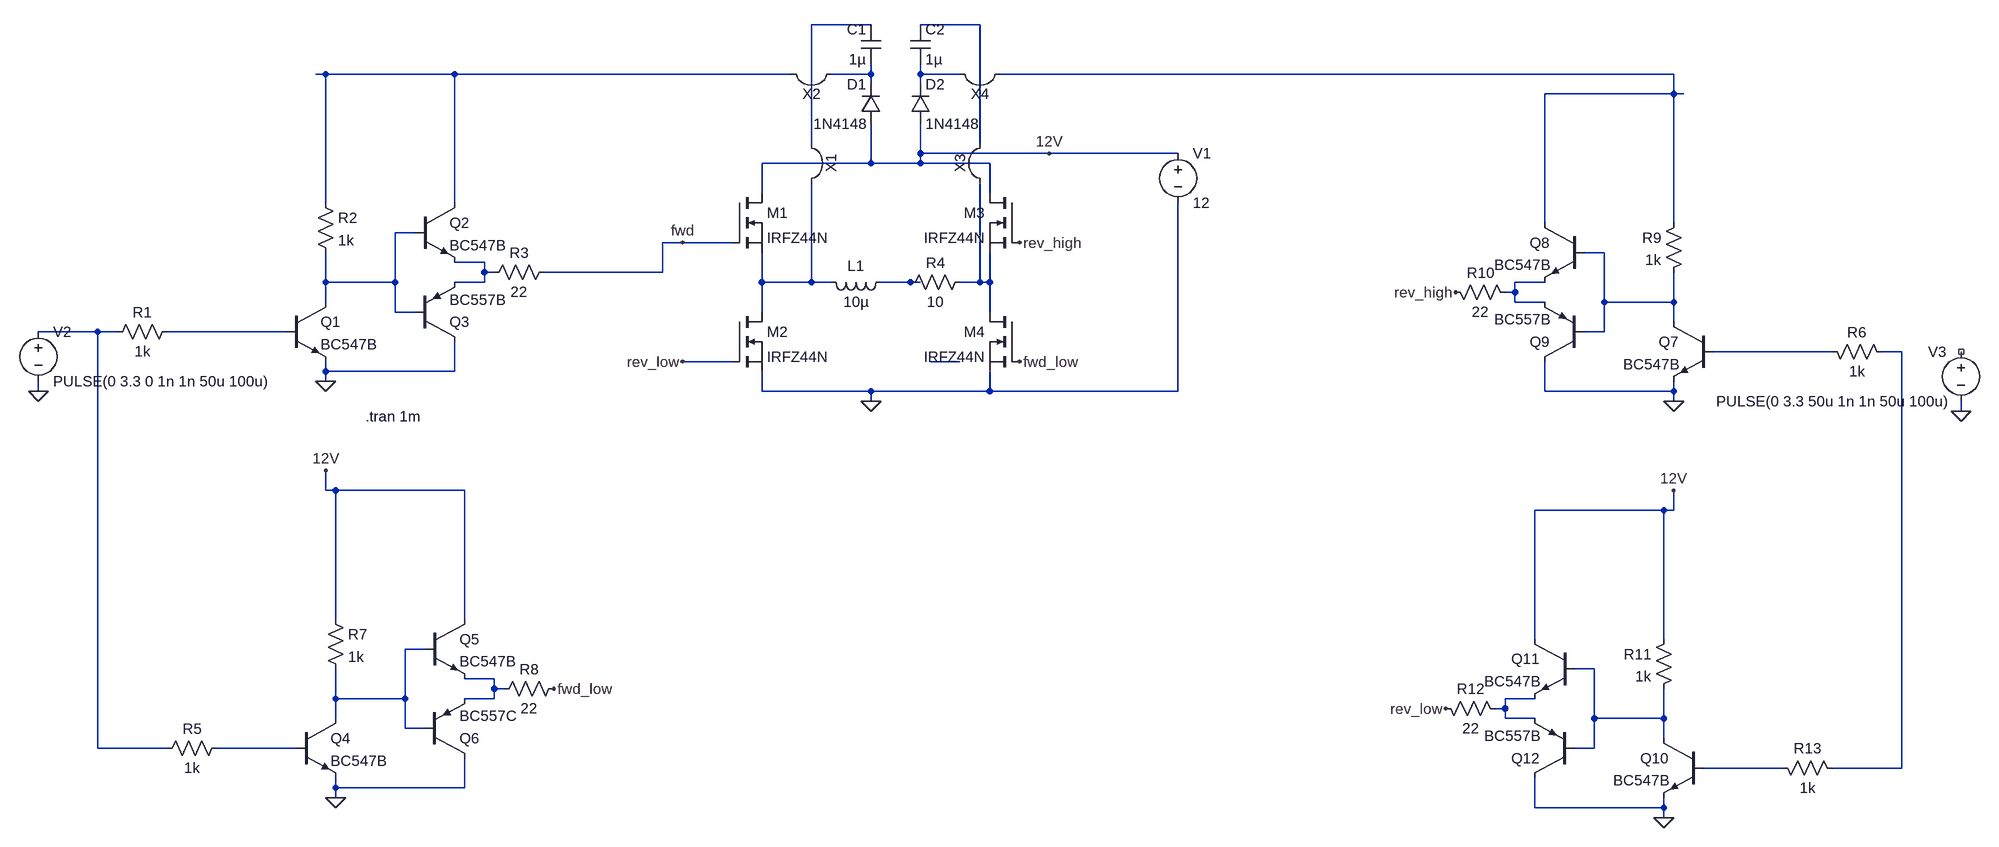
[diagram p0: schematic h-bridge.asc]
h-bridge.asc, the LTspice schematic file:
Version 4
SHEET 1 2020 1028
WIRE 224 -272 128 -272
WIRE 400 -272 304 -272
WIRE -656 -192 -672 -192
WIRE -448 -192 -656 -192
WIRE 96 -192 -448 -192
WIRE 224 -192 224 -208
WIRE 224 -192 160 -192
WIRE 304 -192 304 -208
WIRE 368 -192 304 -192
WIRE 1520 -192 432 -192
WIRE 224 -176 224 -192
WIRE 304 -176 304 -192
WIRE 1520 -160 1520 -192
WIRE 1520 -160 1312 -160
WIRE 1536 -160 1520 -160
WIRE 128 -80 128 -272
WIRE 400 -80 400 -272
WIRE 304 -64 304 -112
WIRE 512 -64 304 -64
WIRE 720 -64 512 -64
WIRE 224 -48 224 -112
WIRE 224 -48 48 -48
WIRE 304 -48 304 -64
WIRE 304 -48 224 -48
WIRE 416 -48 304 -48
WIRE 48 0 48 -48
WIRE 416 0 416 -48
WIRE -656 16 -656 -192
WIRE -448 16 -448 -192
WIRE 1312 48 1312 -160
WIRE 1520 48 1520 -160
WIRE -512 64 -544 64
WIRE -80 80 -112 80
WIRE 0 80 -80 80
WIRE 1408 96 1376 96
WIRE -400 112 -448 112
WIRE -400 128 -400 112
WIRE -384 128 -400 128
WIRE -112 128 -112 80
WIRE -112 128 -304 128
WIRE -656 144 -656 96
WIRE -544 144 -544 64
WIRE -544 144 -656 144
WIRE -400 144 -400 128
WIRE -400 144 -448 144
WIRE 48 144 48 96
WIRE 128 144 128 -16
WIRE 128 144 48 144
WIRE 160 144 128 144
WIRE 288 144 240 144
WIRE 304 144 288 144
WIRE 400 144 400 -16
WIRE 400 144 368 144
WIRE 416 144 416 96
WIRE 416 144 400 144
WIRE 1312 144 1264 144
WIRE 1264 160 1264 144
WIRE 1264 160 1248 160
WIRE -656 176 -656 144
WIRE 1264 176 1264 160
WIRE 1312 176 1264 176
WIRE 1408 176 1408 96
WIRE 1520 176 1520 128
WIRE 1520 176 1408 176
WIRE -544 192 -544 144
WIRE -512 192 -544 192
WIRE 48 192 48 144
WIRE 416 192 416 144
WIRE 1520 208 1520 176
WIRE -1024 224 -1120 224
WIRE -992 224 -1024 224
WIRE -720 224 -912 224
WIRE 1408 224 1408 176
WIRE 1408 224 1376 224
WIRE 1776 256 1584 256
WIRE 1888 256 1856 256
WIRE 0 272 -80 272
WIRE 368 272 320 272
WIRE -656 288 -656 272
WIRE -448 288 -448 240
WIRE -448 288 -656 288
WIRE -656 304 -656 288
WIRE -1120 320 -1120 304
WIRE 48 320 48 288
WIRE 224 320 48 320
WIRE 416 320 416 288
WIRE 416 320 224 320
WIRE 720 320 720 16
WIRE 720 320 416 320
WIRE 1312 320 1312 272
WIRE 1520 320 1520 304
WIRE 1520 320 1312 320
WIRE 224 336 224 320
WIRE 1520 336 1520 320
WIRE 1984 352 1984 336
WIRE -656 480 -656 448
WIRE -640 480 -656 480
WIRE -432 480 -640 480
WIRE 1504 512 1296 512
WIRE 1520 512 1520 480
WIRE 1520 512 1504 512
WIRE -640 688 -640 480
WIRE -432 688 -432 480
WIRE 1296 720 1296 512
WIRE 1504 720 1504 512
WIRE -496 736 -528 736
WIRE 1392 768 1360 768
WIRE -384 784 -432 784
WIRE -384 800 -384 784
WIRE -368 800 -384 800
WIRE -640 816 -640 768
WIRE -528 816 -528 736
WIRE -528 816 -640 816
WIRE -384 816 -384 800
WIRE -384 816 -432 816
WIRE 1296 816 1248 816
WIRE 1248 832 1248 816
WIRE 1248 832 1232 832
WIRE -640 848 -640 816
WIRE 1248 848 1248 832
WIRE 1296 848 1248 848
WIRE 1392 848 1392 768
WIRE 1504 848 1504 800
WIRE 1504 848 1392 848
WIRE -528 864 -528 816
WIRE -496 864 -528 864
WIRE 1504 880 1504 848
WIRE -1024 896 -1024 224
WIRE -912 896 -1024 896
WIRE -704 896 -832 896
WIRE 1392 896 1392 848
WIRE 1392 896 1360 896
WIRE 1696 928 1568 928
WIRE 1888 928 1888 256
WIRE 1888 928 1776 928
WIRE -640 960 -640 944
WIRE -432 960 -432 912
WIRE -432 960 -640 960
WIRE -640 976 -640 960
WIRE 1296 992 1296 944
WIRE 1504 992 1504 976
WIRE 1504 992 1296 992
WIRE 1504 1008 1504 992
FLAG 224 336 0
FLAG -1120 320 0
FLAG -656 304 0
FLAG -80 80 fwd
FLAG 464 272 fwd_low
FLAG -640 976 0
FLAG -288 800 fwd_low
FLAG 512 -64 12V
FLAG -656 448 12V
FLAG 1984 352 0
FLAG 1520 336 0
FLAG 1504 1008 0
FLAG 1152 832 rev_low
FLAG 1520 480 12V
FLAG 1168 160 rev_high
FLAG 464 80 rev_high
FLAG -80 272 rev_low
SYMBOL nmos 0 0 R0
SYMATTR InstName M1
SYMATTR Value IRFZ44N
SYMBOL nmos 0 192 R0
SYMATTR InstName M2
SYMATTR Value IRFZ44N
SYMBOL nmos 464 0 M0
SYMATTR InstName M3
SYMATTR Value IRFZ44N
SYMBOL nmos 464 192 M0
SYMATTR InstName M4
SYMATTR Value IRFZ44N
SYMBOL voltage 720 -80 R0
WINDOW 123 0 0 Left 0
WINDOW 39 0 0 Left 0
SYMATTR InstName V1
SYMATTR Value 12
SYMBOL voltage -1120 208 R0
WINDOW 123 0 0 Left 0
WINDOW 39 0 0 Left 0
SYMATTR InstName V2
SYMATTR Value PULSE(0 3.3 0 1n 1n 50u 100u)
SYMBOL res -896 208 R90
WINDOW 0 0 56 VBottom 2
WINDOW 3 32 56 VTop 2
SYMATTR InstName R1
SYMATTR Value 1k
SYMBOL npn -720 176 R0
SYMATTR InstName Q1
SYMATTR Value BC547B
SYMBOL npn -512 16 R0
SYMATTR InstName Q2
SYMATTR Value BC547B
SYMBOL res -672 0 R0
SYMATTR InstName R2
SYMATTR Value 1k
SYMBOL diode 240 -112 R180
WINDOW 0 24 64 Left 2
WINDOW 3 24 0 Left 2
SYMATTR InstName D1
SYMATTR Value 1N4148
SYMBOL cap 240 -208 R180
WINDOW 0 24 56 Left 2
WINDOW 3 24 8 Left 2
SYMATTR InstName C1
SYMATTR Value 1µ
SYMBOL Misc\\jumper 192 -48 R90
SYMATTR InstName X1
SYMBOL Misc\\jumper 128 -128 R180
SYMATTR InstName X2
SYMBOL pnp -512 240 M180
SYMATTR InstName Q3
SYMATTR Value BC557B
SYMBOL res -288 112 R90
WINDOW 0 0 56 VBottom 2
WINDOW 3 32 56 VTop 2
SYMATTR InstName R3
SYMATTR Value 22
SYMBOL res 384 128 R90
WINDOW 0 0 56 VBottom 2
WINDOW 3 32 56 VTop 2
SYMATTR InstName R4
SYMATTR Value 10
SYMBOL npn -704 848 R0
SYMATTR InstName Q4
SYMATTR Value BC547B
SYMBOL npn -496 688 R0
SYMATTR InstName Q5
SYMATTR Value BC547B
SYMBOL res -656 672 R0
SYMATTR InstName R7
SYMATTR Value 1k
SYMBOL pnp -496 912 M180
SYMATTR InstName Q6
SYMATTR Value BC557C
SYMBOL res -272 784 R90
WINDOW 0 0 56 VBottom 2
WINDOW 3 32 56 VTop 2
SYMATTR InstName R8
SYMATTR Value 22
SYMBOL res -816 880 R90
WINDOW 0 0 56 VBottom 2
WINDOW 3 32 56 VTop 2
SYMATTR InstName R5
SYMATTR Value 1k
SYMBOL voltage 1984 240 M0
WINDOW 123 0 0 Left 0
WINDOW 39 0 0 Left 0
SYMATTR InstName V3
SYMATTR Value PULSE(0 3.3 50u 1n 1n 50u 100u)
SYMBOL res 1760 240 M90
WINDOW 0 0 56 VBottom 2
WINDOW 3 32 56 VTop 2
SYMATTR InstName R6
SYMATTR Value 1k
SYMBOL npn 1584 208 M0
SYMATTR InstName Q7
SYMATTR Value BC547B
SYMBOL npn 1376 48 M0
SYMATTR InstName Q8
SYMATTR Value BC547B
SYMBOL res 1536 32 M0
SYMATTR InstName R9
SYMATTR Value 1k
SYMBOL pnp 1376 272 R180
SYMATTR InstName Q9
SYMATTR Value BC557B
SYMBOL res 1152 144 M90
WINDOW 0 0 56 VBottom 2
WINDOW 3 32 56 VTop 2
SYMATTR InstName R10
SYMATTR Value 22
SYMBOL npn 1568 880 M0
SYMATTR InstName Q10
SYMATTR Value BC547B
SYMBOL npn 1360 720 M0
SYMATTR InstName Q11
SYMATTR Value BC547B
SYMBOL res 1520 704 M0
SYMATTR InstName R11
SYMATTR Value 1k
SYMBOL pnp 1360 944 R180
SYMATTR InstName Q12
SYMATTR Value BC557B
SYMBOL res 1136 816 M90
WINDOW 0 0 56 VBottom 2
WINDOW 3 32 56 VTop 2
SYMATTR InstName R12
SYMATTR Value 22
SYMBOL res 1680 912 M90
WINDOW 0 0 56 VBottom 2
WINDOW 3 32 56 VTop 2
SYMATTR InstName R13
SYMATTR Value 1k
SYMBOL diode 288 -112 M180
WINDOW 0 24 64 Left 2
WINDOW 3 24 0 Left 2
SYMATTR InstName D2
SYMATTR Value 1N4148
SYMBOL cap 288 -208 M180
WINDOW 0 24 56 Left 2
WINDOW 3 24 8 Left 2
SYMATTR InstName C2
SYMATTR Value 1µ
SYMBOL Misc\\jumper 336 -48 M90
SYMATTR InstName X3
SYMBOL Misc\\jumper 400 -128 M180
SYMATTR InstName X4
SYMBOL ind 256 128 R90
WINDOW 0 5 56 VBottom 2
WINDOW 3 32 56 VTop 2
SYMATTR InstName L1
SYMATTR Value 10µ
TEXT -592 360 Left 2 !.tran 1m

The netlist it stands for:
* h-bridge.asc
M1 12V fwd N001 N001 IRFZ44N
M2 N001 rev_low 0 0 IRFZ44N
M3 12V rev_high N002 N002 IRFZ44N
M4 N002 fwd_low 0 0 IRFZ44N
V1 12V 0 12
V2 N010 0 PULSE(0 3.3 0 1n 1n 50u 100u)
R1 N011 N010 1k
Q1 N005 N011 0 0 BC547B
Q2 N003 N005 N007 0 BC547B
R2 N003 N005 1k
D1 12V N003 1N4148
C1 N003 N001 1µ
Q3 0 N005 N007 0 BC557B
R3 fwd N007 22
R4 N002 N008 10
Q4 N015 N019 0 0 BC547B
Q5 12V N015 N017 0 BC547B
R7 12V N015 1k
Q6 0 N015 N017 0 BC557C
R8 fwd_low N017 22
R5 N019 N010 1k
V3 NC_01 0 PULSE(0 3.3 50u 1n 1n 50u 100u)
R6 N012 N013 1k
Q7 N006 N012 0 0 BC547B
Q8 N004 N006 N009 0 BC547B
R9 N004 N006 1k
Q9 0 N006 N009 0 BC557B
R10 rev_high N009 22
Q10 N016 N020 0 0 BC547B
Q11 12V N016 N018 0 BC547B
R11 12V N016 1k
Q12 0 N016 N018 0 BC557B
R12 rev_low N018 22
R13 N020 N013 1k
D2 12V N004 1N4148
C2 N004 N002 1µ
L1 N008 N001 10µ
.model D D
.lib standard.dio
.model NPN NPN
.model PNP PNP
.lib standard.bjt
.model NMOS NMOS
.model PMOS PMOS
.lib standard.mos
.tran 1m
.backanno
.end